# EAGLE design sra_board_2020 (EAGLE 9.6.2)
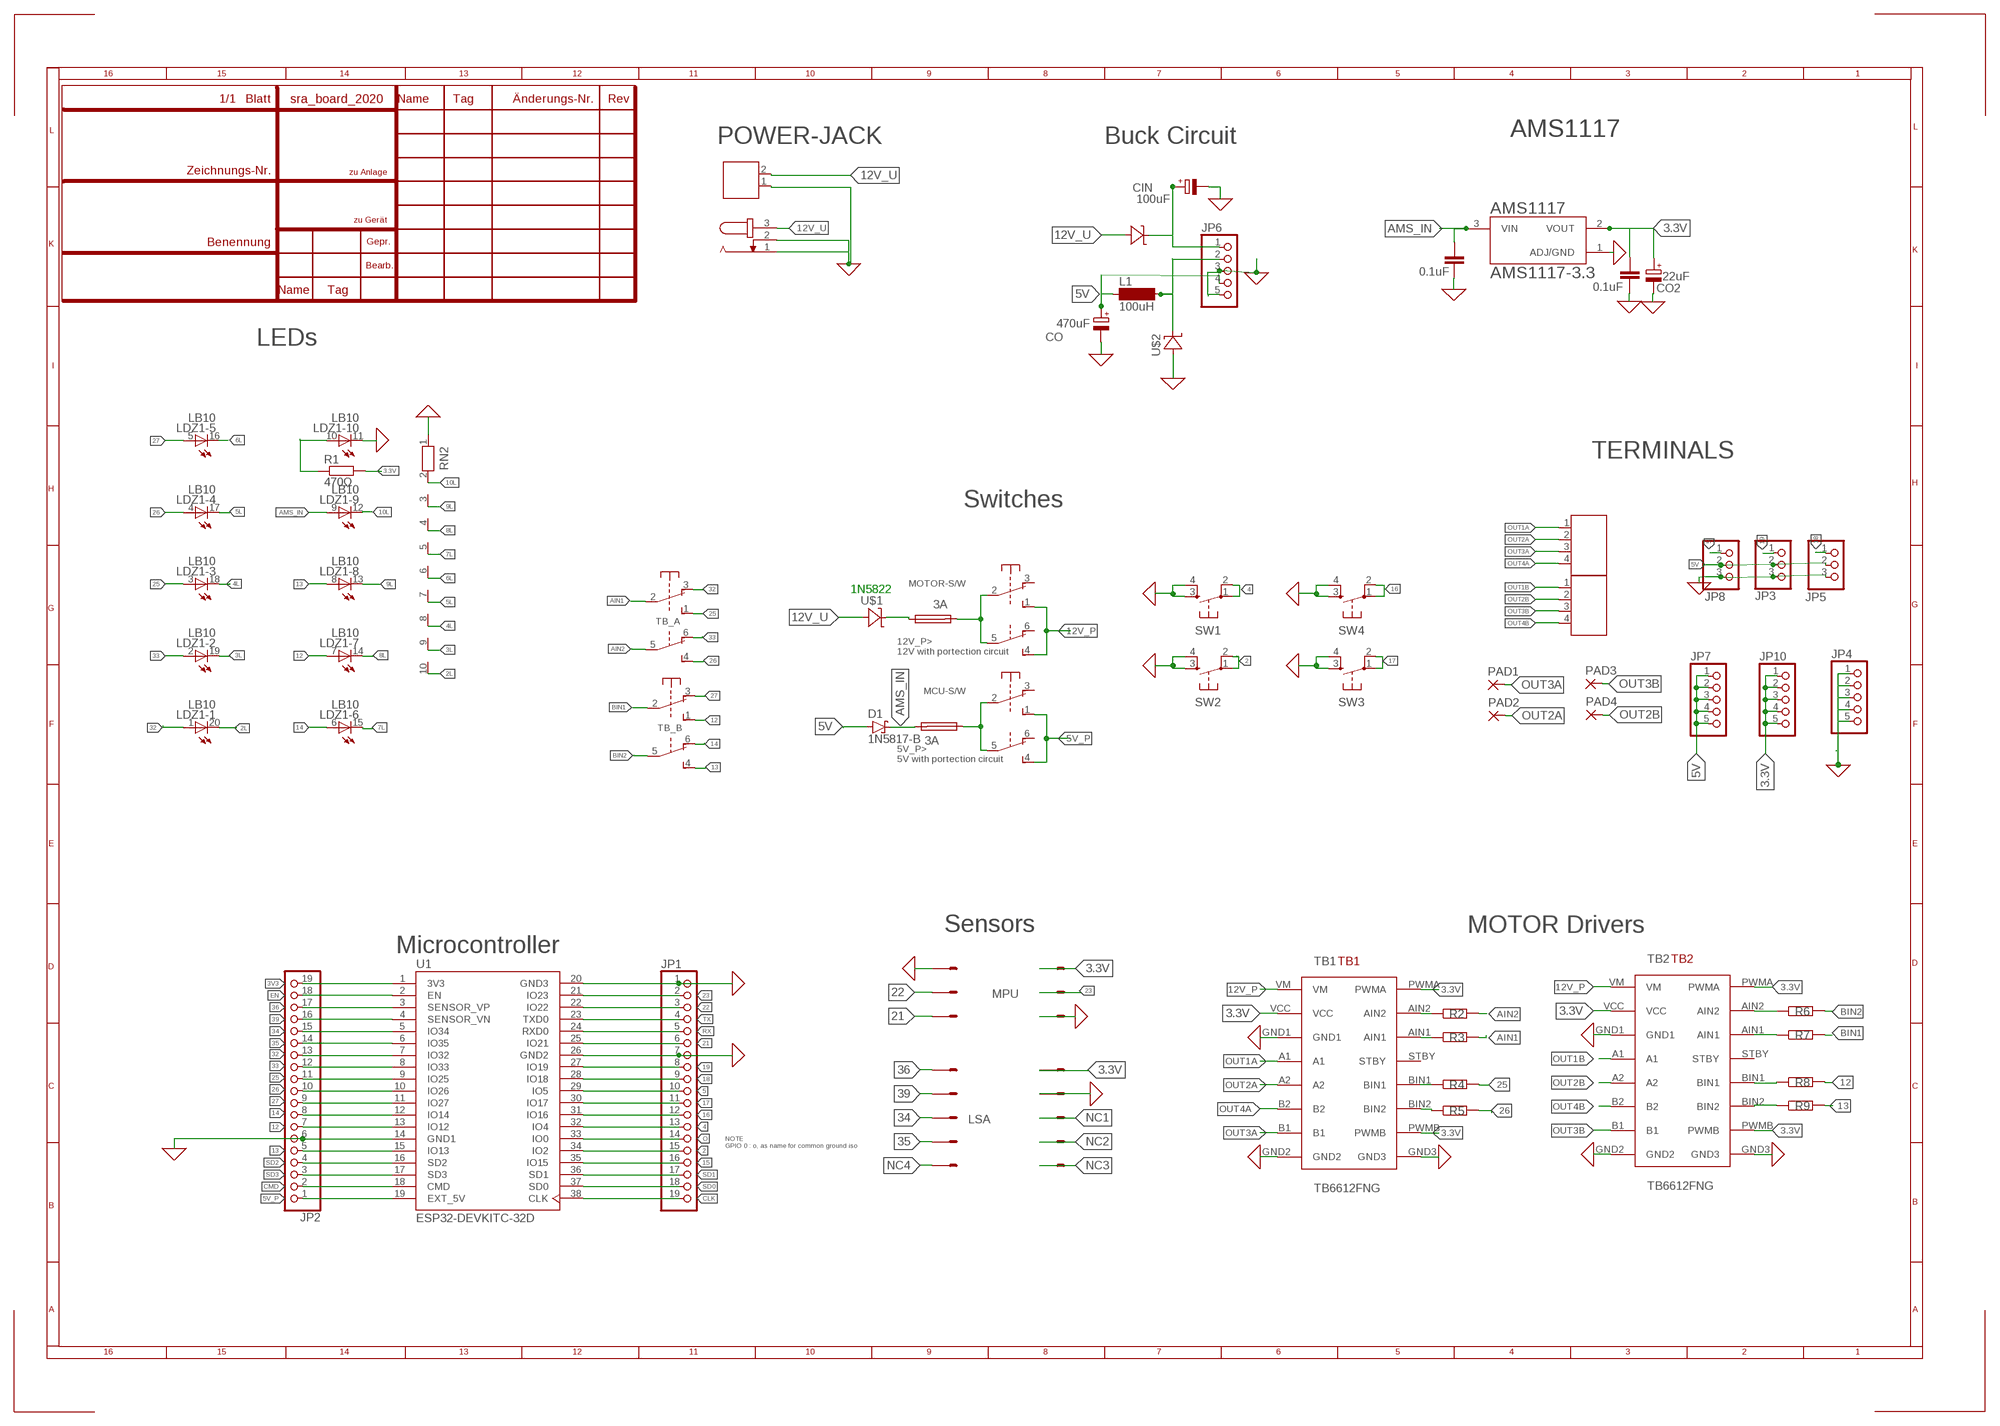
[diagram p0: schematic, sheet 1]

## Parts
12V  691131710002  [691131710002]
AMS1117  AMS1117-3.3  [SOT229P700X180-4N]
CIN  100uF  CPOL-EUE2.5-6  [E2,5-6]
CIN1  0.1uF  C5/2.5  [C5B2.5]
CO  470uF  CPOL-EUE3.5-10  [E3,5-10]
CO1  0.1uF  C5/2.5  [C5B2.5]
CO2  22uF  CPOL-EUE2.5-6  [E2,5-6]
D1  1N5817-B  [DO41-7.6]
F2  3A  SH25  [SH25]
F3  3A  SH25  [SH25]
J1  691131710004  [691131710004]
J2  691131710004  [691131710004]
JP1  PINHD-1X19  [1X19]
JP2  PINHD-1X19  [1X19]
JP3  PINHD-1X3  [1X03]
JP4  PINHD-1X5  [1X05]
JP5  PINHD-1X3  [1X03]
JP6  PINHD-1X5  [1X05]
JP7  PINHD-1X5  [1X05]
JP8  PINHD-1X3  [1X03]
JP10  PINHD-1X5  [1X05]
L1  100uH  SD12K100  [SD12K100]
LDZ1  LB10  [LB10]
LINE-SENSOR  057-010-1  [057-010-1]
MCU-S/W  9077-2  [9077-2]
MOTOR-S/W  9077-2  [9077-2]
PAD1  SMD2  [SMD1,27-2,54]
PAD2  SMD2  [SMD1,27-2,54]
PAD3  SMD2  [SMD1,27-2,54]
PAD4  SMD2  [SMD1,27-2,54]
POWER-JACK  JACK-PLUG1  [SPC4078]
R1  470Ω  R-EU_0204/7  [0204/7]
R2  1KΩ  R-EU_0204/7  [0204/7]
R3  1KΩ  R-EU_0204/7  [0204/7]
R4  1KΩ  R-EU_0204/7  [0204/7]
R5  1KΩ  R-EU_0204/7  [0204/7]
R6  1KΩ  R-EU_0204/7  [0204/7]
R7  1KΩ  R-EU_0204/7  [0204/7]
R8  1KΩ  R-EU_0204/7  [0204/7]
R9  1KΩ  R-EU_0204/7  [0204/7]
RN2  RN09  [RN-10]
SW1  DTS-6  [DTS-6]
SW2  DTS-6  [DTS-6]
SW3  DTS-6  [DTS-6]
SW4  DTS-6  [DTS-6]
TB1  TB6612FNG  [TB6612FNG]
TB2  TB6612FNG  [TB6612FNG]
TB_A  9077-2  [9077-2]
TB_B  9077-2  [9077-2]
U1  ESP32-DEVKITC-32D  [MODULE_ESP32-DEVKITC-32D]
U$1  1N5399_SQUARE  [C2673]
U$2  1N5399_SQUARE  [C2673]
U$3  1N5399_ROUND  [D-10]
X1  057-006-1  [057-006-1]

## Nets
0: 12V.1 AMS1117.1(ADJ/GND) CIN1.1 CIN.- CO1.1 CO2.- CO.- JP1.1 JP1.7 JP2.6 JP3.3 JP4.1 JP4.2 JP4.3 JP4.4 JP4.5 JP5.3 JP6.3 JP6.5 JP8.3 LDZ1.11(-10:C) LINE-SENSOR.4 POWER-JACK.1 POWER-JACK.2 RN2.1 SW1.3 SW1.4 SW2.3 SW2.4 SW3.3 SW3.4 SW4.3 SW4.4 TB1.GND1 TB1.GND2 TB1.GND3 TB2.GND1 TB2.GND2 TB2.GND3 U1.14(GND1) U1.20(GND3) U1.26(GND2) U$2.A X1.1 X1.6 ; supply symbol labelled GND
2: JP1.15 SW2.1 SW2.2 U1.34(IO2)
2L: LDZ1.20(-1:C) RN2.10
3.3V: AMS1117.2(VOUT) CO1.2 CO2.+ JP10.1 JP10.2 JP10.3 JP10.4 JP10.5 LINE-SENSOR.2 R1.2 TB1.PWMA TB1.PWMB TB1.VCC TB2.PWMA TB2.PWMB TB2.VCC X1.2
3L: LDZ1.19(-2:C) RN2.9
3V3: JP2.19 U1.1(3V3)
4: JP1.13 SW1.1 SW1.2 U1.32(IO4)
4L: LDZ1.18(-3:C) RN2.8
5: JP1.10 JP8.1 U1.29(IO5)
5_AF: F2.1 MCU-S/W.2(1:P) MCU-S/W.5(2:P)
5L: LDZ1.17(-4:C) RN2.7
5V: CO.+ D1.A JP3.2 JP5.2 JP6.4 JP7.1 JP7.2 JP7.3 JP7.4 JP7.5 JP8.2 L1.1
5V_P: JP2.1 MCU-S/W.1(1:S) MCU-S/W.4(2:S) U1.19(EXT_5V)
6L: LDZ1.16(-5:C) RN2.6
7L: LDZ1.15(-6:C) RN2.5
8L: LDZ1.14(-7:C) RN2.4
9L: LDZ1.13(-8:C) RN2.3
10L: LDZ1.12(-9:C) RN2.2
12: JP2.7 LDZ1.7(-7:A) R8.2 TB_B.1(1:S) U1.13(IO12)
12V_AF: F3.2 MOTOR-S/W.2(1:P) MOTOR-S/W.5(2:P)
12V_P: MOTOR-S/W.1(1:S) MOTOR-S/W.4(2:S) TB1.VM TB2.VM
12V_U: 12V.2 POWER-JACK.3 U$1.A U$3.A
13: JP2.5 LDZ1.8(-8:A) R9.2 TB_B.4(2:S) U1.15(IO13)
14: JP2.8 LDZ1.6(-6:A) TB_B.6(2:O) U1.12(IO14)
15: JP1.16 U1.35(IO15)
16: JP1.12 SW4.1 SW4.2 U1.31(IO16)
17: JP1.11 SW3.1 SW3.2 U1.30(IO17)
18: JP1.9 JP5.1 U1.28(IO18)
19: JP1.8 JP3.1 U1.27(IO19)
21: JP1.6 U1.25(IO21) X1.5
22: JP1.3 U1.22(IO22) X1.3
23: JP1.2 U1.21(IO23) X1.4
25: JP2.11 LDZ1.3(-3:A) R4.2 TB_A.1(1:S) U1.9(IO25)
26: JP2.10 LDZ1.4(-4:A) R5.2 TB_A.4(2:S) U1.10(IO26)
27: JP2.9 LDZ1.5(-5:A) TB_B.3(1:O) U1.11(IO27)
32: JP2.13 LDZ1.1(-1:A) TB_A.3(1:O) U1.7(IO32)
33: JP2.12 LDZ1.2(-2:A) TB_A.6(2:O) U1.8(IO33)
34: JP2.15 LINE-SENSOR.5 U1.5(IO34)
35: JP2.14 LINE-SENSOR.7 U1.6(IO35)
36: JP2.17 LINE-SENSOR.1 U1.3(SENSOR_VP)
39: JP2.16 LINE-SENSOR.3 U1.4(SENSOR_VN)
AIN1: R3.2 TB_A.2(1:P)
AIN2: R2.2 TB_A.5(2:P)
AMS_IN: AMS1117.3(VIN) CIN1.2 D1.C F2.2 LDZ1.9(-9:A)
BIN1: R7.2 TB_B.2(1:P)
BIN2: R6.2 TB_B.5(2:P)
CLK: JP1.19 U1.38(CLK)
CMD: JP2.2 U1.18(CMD)
EN: JP2.18 U1.2(EN)
N$1: LDZ1.10(-10:A) R1.1
N$3: R2.1 TB1.AIN2
N$4: R3.1 TB1.AIN1
N$5: R4.1 TB1.BIN1
N$6: R5.1 TB1.BIN2
N$7: R6.1 TB2.AIN2
N$8: R7.1 TB2.AIN1
N$9: R8.1 TB2.BIN1
N$10: R9.1 TB2.BIN2
N$11: JP6.2 L1.2 U$2.C
N$12: F3.1 U$1.C
N$13: CIN.+ JP6.1 U$3.C
NC1: LINE-SENSOR.6
NC2: LINE-SENSOR.8
NC3: LINE-SENSOR.10
NC4: LINE-SENSOR.9
O: JP1.14 U1.33(IO0)
OUT1A: J1.1 TB1.A1
OUT1B: J2.1 TB2.A1
OUT2A: J1.2 PAD2.1(P) TB1.A2
OUT2B: J2.2 PAD4.1(P) TB2.A2
OUT3A: J1.3 PAD1.1(P) TB1.B1
OUT3B: J2.3 PAD3.1(P) TB2.B1
OUT4A: J1.4 TB1.B2
OUT4B: J2.4 TB2.B2
RX: JP1.5 U1.24(RXD0)
SD0: JP1.18 U1.37(SD0)
SD1: JP1.17 U1.36(SD1)
SD2: JP2.4 U1.16(SD2)
SD3: JP2.3 U1.17(SD3)
TX: JP1.4 U1.23(TXD0)
Unconnected: MCU-S/W.3(1:O) MCU-S/W.6(2:O) MOTOR-S/W.3(1:O) MOTOR-S/W.6(2:O) TB1.STBY TB2.STBY

## Notes on the sheet
- Buck Circuit | AMS1117
- LEDs
- TERMINALS
- Switches
- 1N5822
- 12V_P>
  12V with portection circuit
- 5V_P> 
  5V with portection circuit
- MOTOR Drivers
- Microcontroller | Sensors
- MPU
- LSA
- NOTE
  GPIO 0 : o, as name for common ground iso

## Library data of the parts
12V = Wurth_Elektronik_Electromechanic_Terminal_Blocks_Connectors_rev16b:691131710002: WR-TBL Terminal block - CUU5/2 CUU5/2GR - 2 Pins;=>Code : Con_TBL_Screw_PClamp_5.00_6911317100xx_691131710002 <http://katalog.we-online.de/media/images/eican/Con_TBL_Screw_PClamp_5.00_6911317100xx_pf2.jpg> Details see: http://katalog.we-online.de/em/datasheet/6911317100xx.pdf Created 11/23/2014, Karrer Zheng 2014 (C) Wurth Elektronik
AMS1117 = AMS1117-3.3:AMS1117-3.3: Sot223/Pkg 1-Amp 3.3-Volt Low Drop Out Voltage Regulatator; AVAILABILITY: Unavailable; DESCRIPTION: Sot223/Pkg 1-Amp 3.3-Volt Low Drop Out Voltage Regulatator; MF: Advanced Monolithic Systems; MP: AMS1117-3.3; PACKAGE: None; PRICE: None
CIN CO CO2 = rcl:CPOL-EU: POLARIZED CAPACITOR, European symbol; SPICEPREFIX: C
CIN1 CO1 = capacitor-wima:C: CAPACITOR naming: grid - package width
D1 = diode:1N581*: 1.0A SCHOTTKY BARRIER RECTIFIER Source: http://www.diodes.com/datasheets/ds23001.pdf
F2 F3 = fuse:SH25: FUSE HOLDER grid 25 mm, OGN0031 8211, Schurter (Buerklin); MF: SCHURTER; MPN: 0031.8211; OC_FARNELL: 1162741; OC_NEWARK: 96B9380
J1 J2 = Wurth_Elektronik_Electromechanic_Terminal_Blocks_Connectors_rev16b:691131710004: WR-TBL Terminal block - CUU5/4 - 4 Pins;=>Code : Con_TBL_Screw_PClamp_5.00_6911317100xx_691131710004 <http://katalog.we-online.de/media/images/eican/Con_TBL_Screw_PClamp_5.00_6911317100xx_pf2.jpg> Details see: http://katalog.we-online.de/em/datasheet/6911317100xx.pdf Created 11/3/2014, Karrer Zheng 2014 (C) Wurth Elektronik
JP1 JP2 = pinhead:PINHD-1X19: PIN HEADER
JP3 JP5 JP8 = pinhead_2:PINHD-1X3: PIN HEADER
JP4 JP7 JP10 = pinhead_2:PINHD-1X5: PIN HEADER
JP6 = pinhead:PINHD-1X5: PIN HEADER
L1 = inductor-neosid:SD12: INDUCTOR nominal inductance; OC_FARNELL: unknown; OC_NEWARK: unknown
LDZ1 = led:LB10: LED BLOCK 10-LED bar graph, DIL, Siemens
LINE-SENSOR = con-panduit:057-010-: CONNECTOR 10-pin series 057 contact pc board low profile headers; OC_FARNELL: unknown; OC_NEWARK: unknown
MCU-S/W MOTOR-S/W TB_A TB_B = switch-misc:9077-2: MARQUARDT SWITCH 9077.0200 Distributor: Buerklin <https://www.buerklin.com/default.asp?event=ShowArtikel%2812G2822%29&l=d&jump=ArtNr_12G2822>
PAD1-PAD4 = wirepad_2:SMD2: SMD PAD
POWER-JACK = con-jack:JACK-PLUG: DC POWER JACK Power Jack, DC, Right Angle, Through Hole, Rated 5A at 16VDC, PC Terminals Distributor: Farnell (www.Farnell.de) Drawing: 84N1161.pdf / 84N1162.pdf Manufacturer: SPC Technology (www.spctechnology.com) Type: SPC4077 / SPC 4078; OC_FARNELL: unknown; OC_NEWARK: unknown
R1-R9 = rcl:R-EU_: RESISTOR, European symbol; SPICEPREFIX: R
RN2 = resistor-net:RN09: RESISTOR NETWORK; OC_FARNELL: unknown; OC_NEWARK: unknown
SW1-SW4 = switch-tact:DTS-6
TB1 TB2 = TB6612FNG:TB6612FNG
U1 = ESP32-DEVKITC-32D:ESP32-DEVKITC-32D: Eval Board For Esp-Wroom-32; AVAILABILITY: Unavailable; DESCRIPTION: - Transceiver; 802.11 b/g/n _Wi-Fi, WiFi, WLAN_, Bluetooth® Smart Ready 4.x Dual Mode For Use With ESP-WROOM-32; MF: Espressif Systems; MP: ESP32-DEVKITC-32D; PACKAGE: None; PRICE: None
U$1 U$2 = diode_updated:1N5399_SQUARE
U$3 = diode_updated:1N5399_ROUND
X1 = con-panduit:057-006-: CONNECTOR 6-pin series 057 contact pc board low profile headers; OC_FARNELL: unknown; OC_NEWARK: unknown

## Board
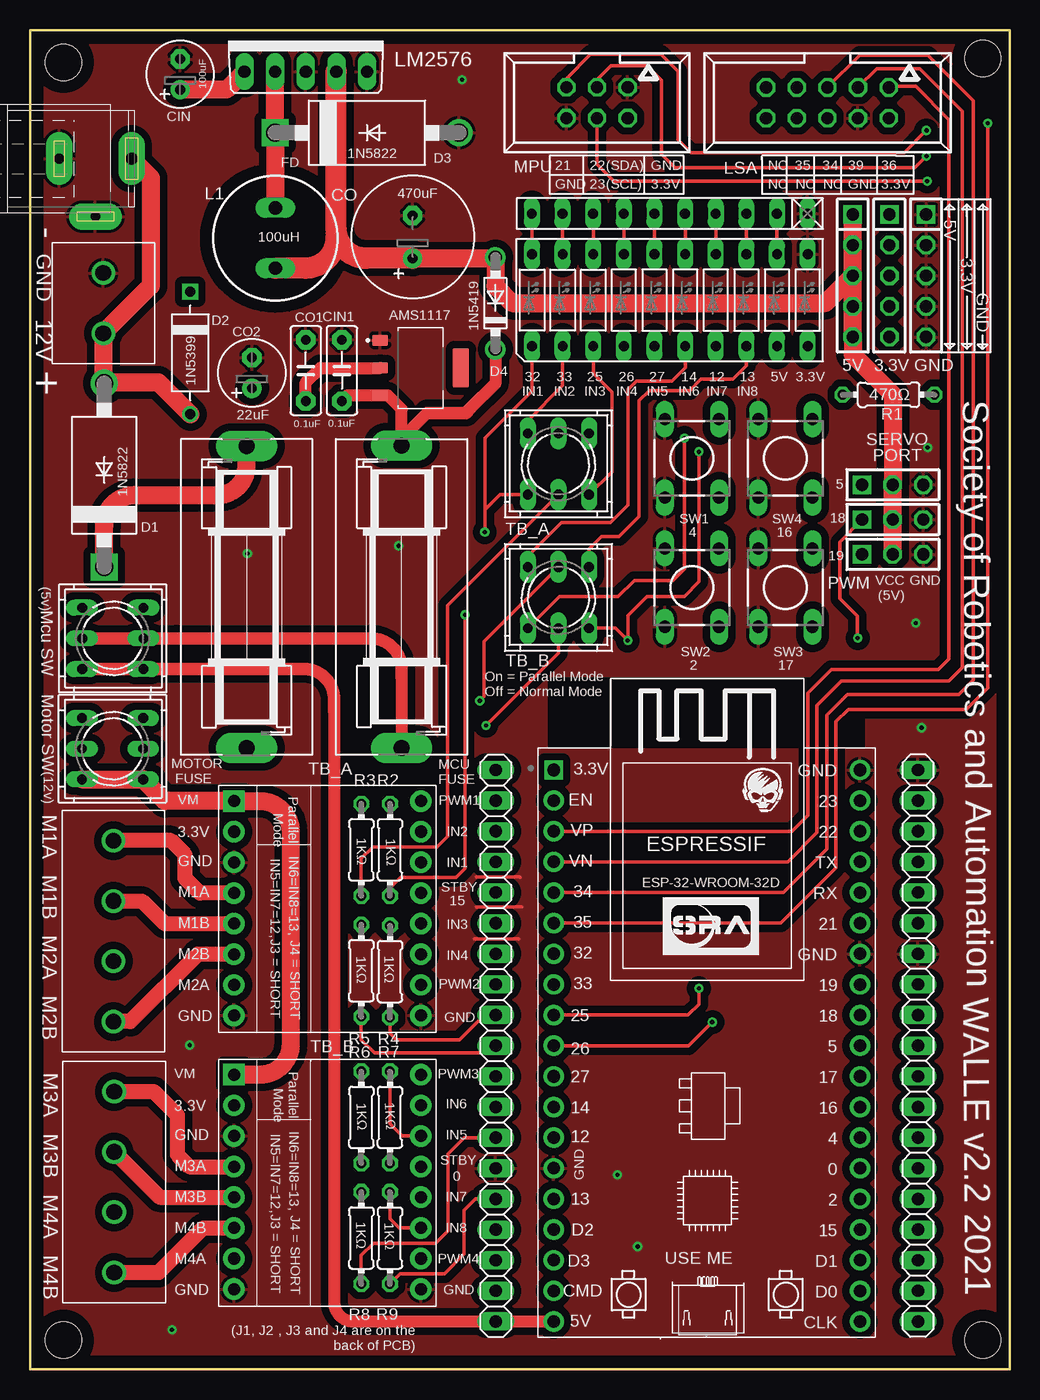
[diagram p1: board, top side]
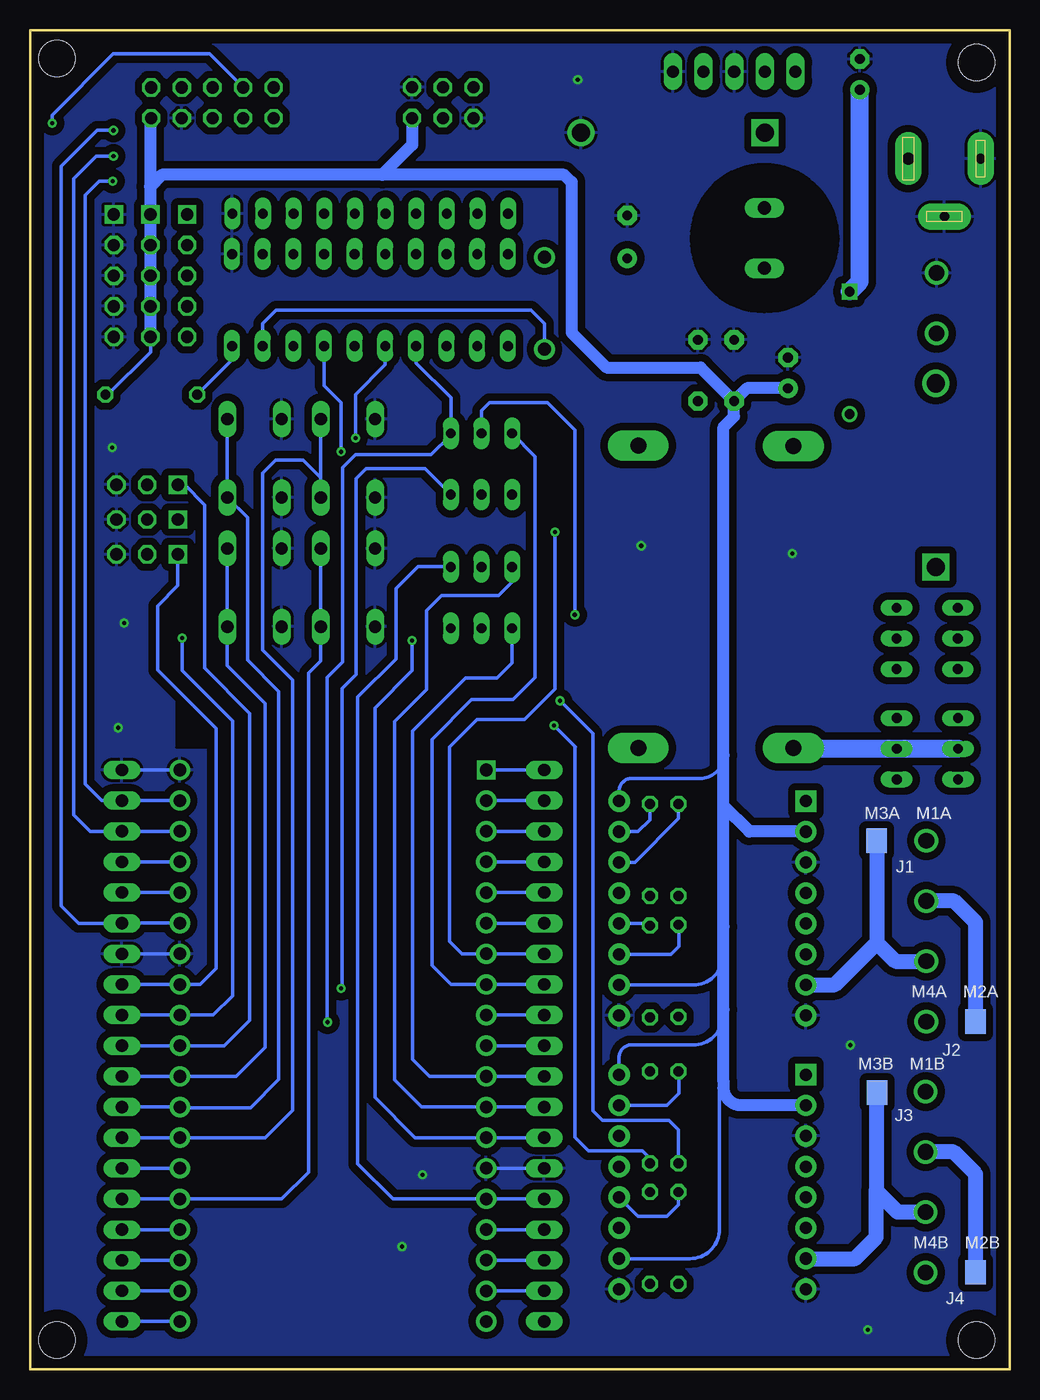
[diagram p2: board, bottom side, seen from below]

Size 81.21 x 111.01 mm. Coordinates in mm from the lower left corner, seen from the top.
Outline: 0,111.01 81.21,111.01 81.21,0 0,0.02 0,111.01
Copper layers (1*16): Top 0.035mm / dielectric 1.5mm / Bottom 0.035mm
Design rules "default": minimum track width 6mil, minimum drill 0.35mm, track to track 6mil, track to pad 6mil, pad to pad 6mil, via to via 6mil, smd to smd 6mil, copper to edge 40mil, drill to drill 6mil, minimum pad ring 10mil, minimum via ring 8mil, stop-mask expansion 4mil, vias tented up to drill 0mil, thermal gap 10mil
Holes 3 mm at 2.75,2.42 78.98,2.42 2.75,108.34 78.98,108.67

### Footprints (pad centres in the part's own frame; a part is rotated, then mirrored left to right if it is on the bottom)
691131710002 = drill 1.3: 1 -2.5,0; 2 2.5,0
SOT229P700X180-4N = smd 0.93 x 1.31: 1 -2.29,-3.345; 2 0,-3.345; 3 2.29,-3.345 | smd 3.24 x 1.31: 4 0,3.345
E2,5-6 = drill 0.813 pad 1.6: + -1.27,0 | drill 0.813 pad 1.6 octagon: - 1.27,0
C5B2.5 = drill 0.813 pad 1.6 octagon: 1 -2.54,0; 2 2.54,0
E3,5-10 = drill 0.813 pad 1.6: + -1.778,0 | drill 0.813 pad 1.6 octagon: - 1.778,0
DO41-7.6 = drill 1.1 pad 1.7: A 3.81,0; C -3.81,0
SH25 = drill 1.321 pad 2.54 long: 1 -12.522,0; 2 12.522,0
691131710004 = drill 1.3: 1 -7.5,0; 2 -2.5,0; 3 2.5,0; 4 7.5,0
1X19 = drill 1.016 long: 1 -22.86,0; 2 -20.32,0; 3 -17.78,0; 4 -15.24,0; 5 -12.7,0; 6 -10.16,0; 7 -7.62,0; 8 -5.08,0; 9 -2.54,0; 10 0,0; 11 2.54,0; 12 5.08,0; 13 7.62,0; 14 10.16,0; 15 12.7,0; 16 15.24,0; 17 17.78,0; 18 20.32,0; 19 22.86,0
1X03 = drill 1.016 square: 1 -2.54,0 | drill 1.016 octagon: 2 0,0; 3 2.54,0
1X05 = drill 1.016 square: 1 -5.08,0 | drill 1.016 octagon: 2 -2.54,0; 3 0,0; 4 2.54,0; 5 5.08,0
1X05' = drill 1.016 long: 1 -5.08,0; 2 -2.54,0; 3 0,0; 4 2.54,0; 5 5.08,0
SD12K100 = drill 1.1 long: 1 -2.5,0; 2 2.5,0
LB10 = drill 0.813 long: 1 -11.43,-3.81; 2 -8.89,-3.81; 3 -6.35,-3.81; 4 -3.81,-3.81; 5 -1.27,-3.81; 6 1.27,-3.81; 7 3.81,-3.81; 8 6.35,-3.81; 9 8.89,-3.81; 10 11.43,-3.81; 11 11.43,3.81; 12 8.89,3.81; 13 6.35,3.81; 14 3.81,3.81; 15 1.27,3.81; 16 -1.27,3.81; 17 -3.81,3.81; 18 -6.35,3.81; 19 -8.89,3.81; 20 -11.43,3.81
057-010-1 = drill 1 octagon: 1 -5.08,-1.27; 2 -5.08,1.27; 3 -2.54,-1.27; 4 -2.54,1.27; 5 0,-1.27; 6 0,1.27; 7 2.54,-1.27; 8 2.54,1.27; 9 5.08,-1.27; 10 5.08,1.27
9077-2 = drill 0.813 long: 1 -2.54,2.54; 2 0,2.54; 3 2.54,2.54; 4 -2.54,-2.54; 5 0,-2.54; 6 2.54,-2.54
SMD1,27-2,54 = smd 1.7 x 2 bottom: 1 0,0
SPC4078 = drill 0.8 pad 2.184 long: 1 -3,0; 2 0,-4.8 | drill 1 pad 2.184 long: 3 3,0
0204/7 = drill 0.813 octagon: 1 -3.81,0; 2 3.81,0
RN-10 = drill 0.813 long: 1 -11.43,0; 2 -8.89,0; 3 -6.35,0; 4 -3.81,0; 5 -1.27,0; 6 1.27,0; 7 3.81,0; 8 6.35,0; 9 8.89,0; 10 11.43,0
DTS-6 = drill 1 long: 1 -3.25,2.25; 2 3.25,2.25; 3 -3.25,-2.25; 4 3.25,-2.25
TB6612FNG = drill 1 pad 1.778: A1 -7.62,-1.27; A2 -7.62,-3.81; AIN1 7.874,1.27; AIN2 7.874,3.81; B1 -7.62,-8.89; B2 -7.62,-6.35; BIN1 7.874,-3.81; BIN2 7.874,-6.35; GND1 -7.62,1.27; GND2 -7.62,-11.43; GND3 7.874,-11.43; PWMA 7.874,6.35; PWMB 7.874,-8.89; STBY 7.874,-1.27; VCC -7.62,3.81 | drill 1 pad 1.778 square: VM -7.62,6.35
MODULE_ESP32-DEVKITC-32D = drill 1.04 square: 1 -12.7,19.76 | drill 1.04 pad 1.676: 2 -12.7,17.22; 3 -12.7,14.68; 4 -12.7,12.14; 5 -12.7,9.6; 6 -12.7,7.06; 7 -12.7,4.52; 8 -12.7,1.98; 9 -12.7,-0.56; 10 -12.7,-3.1; 11 -12.7,-5.64; 12 -12.7,-8.18; 13 -12.7,-10.72; 14 -12.7,-13.26; 15 -12.7,-15.8; 16 -12.7,-18.34; 17 -12.7,-20.88; 18 -12.7,-23.42; 19 -12.7,-25.96; 20 12.7,19.76; 21 12.7,17.22; 22 12.7,14.68; 23 12.7,12.14; 24 12.7,9.6; 25 12.7,7.06; 26 12.7,4.52; 27 12.7,1.98; 28 12.7,-0.56; 29 12.7,-3.1; 30 12.7,-5.64; 31 12.7,-8.18; 32 12.7,-10.72; 33 12.7,-13.26; 34 12.7,-15.8; 35 12.7,-18.34; 36 12.7,-20.88; 37 12.7,-23.42; 38 12.7,-25.96
C2673 = drill 1.499: A 7.62,0 | drill 1.499 square: C -7.62,0
D-10 = drill 0.813: A 5.08,0 | drill 0.813 square: C -5.08,0
057-006-1 = drill 1 octagon: 1 -2.54,-1.27; 2 -2.54,1.27; 3 0,-1.27; 4 0,1.27; 5 2.54,-1.27; 6 2.54,1.27

### Placement (x,y rotation side)
12V  6.06,88.38 270 top
AMS1117  32.37,83.01 270 top
CIN  12.43,107.35 90 top
CIN1  25.85,82.8 270 top
CO  31.71,93.87 90 top
CO1  22.85,82.8 270 top
CO2  18.38,82.59 90 top
D1  38.57,88.38 90 top
F2  30.8,64.03 90 top
F3  17.94,64.02 270 top
J1  6.92,36.33 270 top
J2  6.97,15.53 270 top
JP1  73.6,26.82 270 top
JP2  38.6,26.82 90 top
JP3  71.51,67.56 0 top
JP4  74.27,90.66 270 top
JP5  71.51,70.44 0 top
JP6  [1X05']  22.85,107.57 0 top
JP7  68.19,90.66 270 top
JP8  71.51,73.33 0 top
JP10  71.23,90.66 270 top
L1  20.34,93.78 90 top
LDZ1  53.04,88.64 0 top
LINE-SENSOR  66.1,104.99 180 top
MCU-S/W  6.84,60.59 90 top
MOTOR-S/W  6.83,51.44 90 top
PAD1  11.02,43.83 0 top
PAD2  2.82,28.82 0 top
PAD3  11.01,22.93 0 top
PAD4  2.82,8.04 0 top
POWER-JACK  5.41,100.36 0 top
R1  71.16,80.79 0 top
R2  29.82,43.07 270 top
R3  27.45,43.07 270 top
R4  29.82,32.97 270 top
R5  27.45,33.04 270 top
R6  27.45,20.89 270 top
R7  29.82,20.89 270 top
R8  27.45,10.89 270 top
R9  29.82,10.89 270 top
RN2  53.02,95.81 180 top
SW1  54.86,75.52 270 top
SW2  54.86,64.81 270 top
SW3  62.61,64.81 270 top
SW4  62.61,75.52 270 top
TB1  24.52,40.76 0 top
TB2  24.52,18.07 0 top
TB_A  43.8,75.05 180 top
TB_B  43.8,63.97 180 top
U1  56.1,29.93 0 top
U$1  6.14,74.11 90 top
U$2  27.93,102.5 0 top
U$3  13.27,84.26 270 top
X1  47,105 180 top

### Tracks (layer width: path | path; a pad name or v marks a point on that pad's centre or on a via)
0  (via drill 0.35)
  Top 0.305: 37.03,40.81 40.6,40.81 40.62,40.79 | 36.98,38.32 40.73,38.32 40.76,38.35 | 36.84,35.7 40.47,35.7
  Bottom 0.305: U1.26 JP1.7 | U1.20 JP1.1 | JP2.6 U1.14
  other vias: 13.22,26.88 73.9,53.18 30.55,68.26 18.01,67.63 11.76,3.27 35.82,106.91 74.41,76.41 73.42,61.87 50.37,10.18 48.68,16.12
  pour Bottom (isolate 0.61, rank 2): -2.32,112.05 -2.32,-0.63 4.51,-0.63 83.25,-0.63 83.25,6.15 83.25,112.07 -2.32,112.07
  pour Top (isolate 0.61, rank 2): -2.31,112.04 -2.31,-0.65 0.43,-0.65 83.26,-0.65 83.26,4.25 83.26,112.06 -2.31,112.06
  cutout Top: 43.03,51.52 43.03,57.27 43.08,57.32 69.12,57.32 69.12,51.57 43.03,51.57
  cutout Bottom: 43.03,51.52 43.03,57.32 48.98,57.32 69.12,57.32 69.12,51.57 43.03,51.57
2
  Bottom 0.305: SW2.1 SW2.2 57.11,58.71 58.12,57.7 58.12,16.35 60.34,14.13 U1.34 JP1.15
2L
  Top 0.305: LDZ1.20 41.61,95.8 RN2.10
3.3V
  Top 1: CO1.2 22.85,81.82 24.04,83.01 AMS1117.2
  Bottom 0.305: 23.73,23.85 24.06,23.52 24.06,11.62 arc90 26.5,9.18 TB2.PWMB | JP10.5 71.23,84.34 74.78,80.79 R1.2 | TB1.PWMA 32.39,47.92 arc90 31.32,48.99 25.66,48.99 arc-90 23.73,50.93 | TB1.PWMB 26.27,31.87 arc-90 23.73,34.41 23.73,36.68 | TB2.PWMA 32.39,25.86 arc90 31.36,26.89 26.27,26.89 arc-90 23.73,29.43 23.73,29.82
  Bottom 1: TB2.VCC 22.23,21.88 arc90 23.73,23.39 23.73,23.85 23.73,29.82 23.73,36.68 23.73,46.71 | CO2.+ 21.78,81.32 CO1.2 | CO1.2 25.64,83.05 33.42,83.05 36.32,85.95 36.32,98.41 36.94,99.02 52.02,99.02 | 71.27,98.05 70.29,99.02 52.02,99.02 | 71.27,98.05 71.28,98.04 71.28,103.62 LINE-SENSOR.2 | 71.27,98.05 71.27,95.77 JP10.1 JP10.2 JP10.3 JP10.4 JP10.5 | X1.2 49.54,101.51 52.02,99.02 | 23.73,46.71 23.73,50.93 23.73,78.11 22.85,78.99 CO1.2 | TB1.VCC 21.59,44.57 23.73,46.71
3L
  Top 0.305: LDZ1.19 44.15,95.8 RN2.9
3V3
  Bottom 0.305: JP2.19 U1.1
4
  Bottom 0.305: SW1.1 SW1.2 57.11,73.92 58.56,75.37 60.85,75.37 61.92,74.3 61.92,59.63 59.45,57.15 59.45,21.49 61.73,19.21 U1.32 JP1.13
4L
  Top 0.305: LDZ1.18 46.69,95.8 RN2.8
5
  Bottom 0.305: JP1.10 U1.29 65.12,26.83 63.01,28.94 63.01,54.38 66.75,58.12 66.75,71.66 68.42,73.33 JP8.1
5_AF
  Top 1: 30.79,57.4 F2.1
  Top 1.016: MCU-S/W.2 MCU-S/W.5 12.12,60.59 28.25,60.59 arc-90 30.79,58.05 30.79,57.4
5L
  Top 0.305: LDZ1.17 49.23,95.8 RN2.7
5V
  Top 1.5: JP7.3 JP7.4 JP7.5 68.2,84.12 71.51,80.8 JP8.2 JP5.2 JP3.2 | JP7.3 JP7.2 JP7.1 | JP7.3 65.94,88.4 39.96,88.4 38.57,89.79 D1.A 38.48,92.09 CO.+
  Top 1.75: 25.36,94.63 25.36,93.82 arc-90 22.82,91.28 L1.1 | CO.+ 27.9,92.09 arc-90 25.36,94.63 | 25.36,94.63 25.36,107.54 arc-90 JP6.4
5V_P
  Top 1: U1.19 arc90 U1.19 arc-90 U1.19 | 25.21,54.56 25.21,5.55 arc90 26.8,3.96 JP2.1 U1.19
  Top 1.016: MCU-S/W.1 MCU-S/W.4 22.67,58.05 arc-90 25.21,55.51 25.21,54.56
6L
  Top 0.305: LDZ1.16 51.77,95.8 RN2.6
7L
  Top 0.305: LDZ1.15 54.31,95.8 RN2.5
8L
  Top 0.305: LDZ1.14 56.85,95.8 RN2.4
9L
  Top 0.305: LDZ1.13 59.39,95.8 RN2.3
10L
  Top 0.305: LDZ1.12 61.93,95.8 RN2.2
12  (via drill 0.35)
  Top 0.305: TB_B.1 48.54,61.43 v49.54,60.42 49.54,62.48 51.14,64.07 54.22,64.07 55.44,65.3 v55.44,76.06 | R8.2 27.45,9.46 28.46,10.46 33.62,10.46 34.63,11.47 34.63,17.84 35.99,19.2 JP2.7
  Bottom 0.305: v49.54,60.42 49.54,57.91 52.62,54.84 52.62,22.54 49.29,19.21 U1.13 JP2.7 | LDZ1.7 56.85,81.56 55.44,80.16 v55.44,76.06
12V_AF
  Bottom 1.5: MOTOR-S/W.2 MOTOR-S/W.5 17.89,51.44 arc90 F3.2
12V_P
  Top 1.5: MOTOR-S/W.1 MOTOR-S/W.4 11.16,47.11 TB1.VM 19.06,47.11 arc-90 21.6,44.57 21.6,26.96 arc-90 19.06,24.42 TB2.VM
12V_U
  Top 1.5: POWER-JACK.3 10,98.77 10,89.82 12V.2 6.06,81.81 | 6.06,81.81 U$1.A | U$3.A 10.64,81.81 6.06,81.81
13
  Top 0.305: TB_B.4 46.34,68.01 47.35,69.03 48.8,69.03 50.48,70.71 50.48,80.29 51.32,81.13 54.69,81.13 55.62,82.06 58.24,82.06 59.39,83.21 LDZ1.8 | R9.2 30.68,7.94 34.34,7.94 35.98,9.58 35.98,13.18 36.92,14.12 JP2.5
  Bottom 0.305: TB_B.4 46.36,66.54 49.06,66.54 50.88,64.72 50.88,58.9 54.05,55.72 54.05,17.04 51.13,14.13 U1.15 JP2.5
14
  Top 0.305: LDZ1.6 54.31,83.04 53.19,81.92 50.25,81.92 49.55,81.22 49.55,71.64 48.1,70.2 44.06,70.2 41.23,67.36 41.23,66.55 TB_B.6
  Bottom 0.305: TB_B.6 41.26,65.26 42.38,64.13 47.11,64.13 48.34,62.89 48.34,56.35 51,53.7 51,23.99 48.75,21.75 U1.12 JP2.8
15
  Bottom 0.305: U1.35 JP1.16
16
  Bottom 0.305: SW4.1 SW4.2 63.19,70.6 63.19,58.79 60.59,56.2 60.59,24.02 62.95,21.67 68.72,21.67 U1.31 JP1.12
17
  Bottom 0.305: JP1.11 U1.30 64.15,24.29 61.73,26.7 61.73,55.2 64.86,58.32 SW3.2 SW3.1
18  (via drill 0.35)
  Top 0.305: JP5.1 67.11,68.58 67.11,63.9 68.57,62.44 68.57,60.62 v68.61,60.62
  Bottom 0.305: v68.61,60.62 68.61,57.91 64.44,53.74 64.44,30.96 66.04,29.37 U1.28 JP1.9
19
  Bottom 0.305: JP3.1 68.97,64.98 70.65,63.29 70.65,57.96 65.8,53.11 65.8,33.22 67.12,31.91 U1.27 JP1.8
21  (via drill 0.35)
  Top 0.305: X1.5 44.46,106.99 46.47,109.01 52.31,109.01 53.71,107.61 53.71,101.92 54.77,100.87 72.48,100.87 v74.31,102.7
  Bottom 0.305: v74.31,102.7 75.67,102.7 78.62,99.74 78.62,38.43 77.18,36.98 JP1.6 U1.25
22  (via drill 0.35)
  Top 0.305: X1.3 47,106.91 48.15,108.06 51.16,108.06 52.36,106.86 52.36,100.71 53.45,99.61 73.36,99.61 v74.31,100.56
  Bottom 0.305: v74.31,100.56 75.73,100.56 77.59,98.69 77.59,45.95 76.25,44.6 JP1.3 U1.22
23  (via drill 0.35)
  Top 0.305: X1.4 47,99.89 48.39,98.5 v74.36,98.5
  Bottom 0.305: v74.36,98.5 75.49,98.5 76.66,97.32 76.66,94.41 76.66,94.4 76.66,48.51 75.29,47.14 JP1.2 U1.21
25  (via drill 0.35)
  Top 0.305: LDZ1.3 46.69,82.52 48.22,80.99 48.22,74.4 TB_A.1 | R4.2 29.82,27.84 30.34,27.32 35.59,27.32 37.7,29.44 38.53,29.44 JP2.11 | v55.44,31.58 55.44,30.25 54.55,29.37 U1.9
  Bottom 0.305: TB_A.1 48.47,74.65 53.38,74.65 54.2,73.82 54.2,57.59 55.37,56.43 55.37,31.65 v55.44,31.58 | JP2.11 U1.9
26  (via drill 0.35)
  Top 0.305: R5.2 27.45,27.32 28.54,26.23 38.01,26.23 JP2.10 | U1.10 54.59,26.83 v56.55,28.79
  Bottom 0.305: LDZ1.4 49.23,83.42 46.34,80.53 TB_A.4 46.34,77.44 47.96,75.83 47.96,75.82 54.23,75.82 55.31,74.74 55.31,58.63 56.59,57.35 56.59,28.82 v56.55,28.79 | U1.10 JP2.10
27  (via drill 0.35)
  Top 0.305: v54.23,77.18 54.23,66.35 53.29,65.41 50.09,65.41 48.73,64.04 43.87,64.04 TB_B.3
  Bottom 0.305: TB_B.3 41.26,58.55 42.49,57.32 45.11,57.32 49.51,52.92 49.51,25.68 48.11,24.28 U1.11 | LDZ1.5 51.77,83.28 54.23,80.81 v54.23,77.18 | JP2.9 U1.11 | U1.11
32  (via drill 0.35)
  Top 0.305: v37.69,69.41 37.69,71.25 | 37.69,71.25 38.95,72.52 TB_A.3 | 37.69,71.25 37.69,77.18 41.61,81.1 LDZ1.1
  Bottom 0.305: v37.69,69.41 37.69,56.41 40.23,53.88 44.16,53.88 46.44,51.59 46.44,35.47 45.42,34.45 U1.7 JP2.13
33
  Top 0.305: TB_A.6 41.26,78.65 44.15,81.54 LDZ1.2
  Bottom 0.305: TB_A.6 39.34,75.68 39.34,57.37 41.18,55.53 44.6,55.53 47.9,52.23 47.9,33.48 46.33,31.91 U1.8 JP2.12
34
  Top 0.305: U1.5 62.43,39.53 66.06,43.15 66.06,54.23 67.76,55.94 76.97,55.94 78.18,57.14 78.18,105.17 74.42,108.93 68.77,108.93 LINE-SENSOR.5
  Bottom 0.305: JP2.15 U1.5
35  (via drill 0.35)
  Top 0.305: U1.6 62.22,36.99 66.81,41.58 66.81,53.69 67.82,54.7 77.6,54.7 79.38,56.49 v79.38,103.3
  Bottom 0.305: v79.38,103.3 79.38,103.97 74.31,109.05 66.34,109.05 LINE-SENSOR.7 | JP2.14 U1.6
36
  Top 0.305: U1.3 63.17,44.61 64.45,45.9 64.45,56.05 66.42,58.01 75.28,58.01 76.17,58.9 76.17,103.59 73.41,106.35 71.27,106.35 LINE-SENSOR.1
  Bottom 0.305: JP2.17 U1.3
39
  Top 0.305: U1.4 62.81,42.07 65.24,44.49 65.24,55.04 67.26,57.06 76.17,57.06 77.28,58.17 77.28,104.28 73.75,107.81 70.19,107.81 LINE-SENSOR.3
  Bottom 0.305: JP2.16 U1.4
AIN1
  Top 0.305: TB_A.2 34.59,63.3 34.59,44.18 33.72,43.3 28.42,43.3 27.45,42.34 R3.2
AIN2  (via drill 0.35)
  Top 0.305: v36.05,62.55 36.05,41.51 35.32,40.77 30.7,40.77 29.82,39.89 R2.2
  Bottom 0.305: v36.05,62.55 36.05,77.87 38.34,80.15 43.13,80.15 43.8,79.48 TB_A.5
AMS_IN
  Top 1: F2.2 30.79,79.58 29.66,80.72 AMS1117.3 26.3,80.72 CIN1.2 | D1.C 38.57,81.71 36.48,79.62
  Top 1.016: 36.48,79.62 36.14,79.28 32.91,79.28 30.79,77.17 F2.2
  Bottom 0.305: D1.C 38.57,86.67 39.71,87.8 60.81,87.8 61.93,86.69 LDZ1.9
BIN1  (via drill 0.35)
  Top 0.305: v37.79,53.37 43.8,59.38 TB_B.2
  Bottom 0.305: v37.79,53.37 36.02,51.59 36.05,51.57 36.05,19.24 34.91,18.1 30.44,18.1 29.82,17.49 R7.2
BIN2  (via drill 0.35)
  Top 0.305: v37.28,55.43 37.61,55.76 37.61,60.33 TB_B.5
  Bottom 0.305: v37.28,55.43 34.57,52.72 34.57,21.43 33.77,20.63 28.24,20.63 27.45,19.85 R6.2
CLK
  Bottom 0.305: U1.38 JP1.19
CMD
  Bottom 0.305: JP2.2 U1.18
COB
  cutout Bottom: 14.18,93.7 14.18,93.75 arc-90 20.34,99.91 arc-90 26.47,93.78 26.47,93.7 arc-90 20.4,87.63 20.29,87.63 20.27,87.63 arc-90 14.18,93.72
COT
  cutout Top: 14.17,93.72 14.17,93.78 arc-90 20.33,99.93 arc-90 26.46,93.8 26.46,93.72 arc-90 20.39,87.65 20.28,87.65 20.26,87.65 arc-90 14.17,93.74
EN
  Bottom 0.305: JP2.18 U1.2
N$1
  Bottom 0.305: R1.1 64.47,83.68 LDZ1.10
N$3
  Bottom 0.305: TB1.AIN2 30.81,44.57 29.82,45.56 R2.1
N$4
  Bottom 0.305: R3.1 27.45,45.67 31.09,42.03 TB1.AIN1
N$5
  Bottom 0.305: R4.1 29.99,36.95 TB1.BIN1
N$6
  Bottom 0.305: TB1.BIN2 28.1,34.41 27.45,35.07 R5.1
N$7
  Bottom 0.305: TB2.AIN2 28.44,21.88 27.43,22.89 27.43,24.68 R6.1
N$8
  Top 0.305: TB2.AIN1 30.84,19.34 29.82,20.36 R7.1
N$9
  Bottom 0.305: TB2.BIN1 30.83,12.7 28.4,12.7 27.45,13.65 R8.1
N$10
  Top 0.305: R9.1 29.82,12.49 30.59,11.72 TB2.BIN2
N$11
  Top 1.5: 20.34,102.47 arc90 U$2.C | U$2.C JP6.2 arc-90 JP6.2 | L1.2 20.34,102.47 | 20.34,102.47 arc90 U$2.C
N$12
  Top 1.5: U$1.C 6.14,69.93 arc-90 8.68,72.47 15.53,72.47 arc90 17.94,74.89 F3.1
N$13
  Top 1.5: JP6.1 16.27,106.08 CIN.+
  Bottom 1.5: U$3.C 12.43,90.18 CIN.+
O
  Bottom 0.305: U1.33 JP1.14
OUT1A
  Top 1.25: TB1.A1 14.06,39.49 12.84,40.71 12.84,42.66 11.68,43.83 J1.1
OUT1B
  Top 1.25: J2.1 10.25,23.03 12.2,21.07 12.2,17.8 13.2,16.8 TB2.A1
OUT2A
  Top 1.25: J1.2 9.28,38.83 11.16,36.95 TB1.A2
  Bottom 1.25: PAD2.1 2.82,37.05 4.6,38.83 J1.2
OUT2B
  Top 1.25: J2.2 10.73,14.26 TB2.A2
  Bottom 1.25: PAD4.1 2.82,16.19 4.65,18.03 J2.2
OUT3A
  Bottom 1.25: PAD1.1 11.02,35.37 | J1.3 9.48,33.83 11.02,35.37 | TB1.B1 14.52,31.87 11.02,35.37
OUT3B
  Bottom 1.25: J2.3 9.29,13.03 11.06,14.8 | PAD3.1 11.06,22.88 11.06,14.8 | TB2.B1 12.84,9.18 11.06,10.96 11.06,14.8
OUT4A
  Top 1.25: TB1.B2 13.88,34.41 8.3,28.83 J1.4
OUT4B
  Top 1.25: J2.4 10.66,8.03 14.35,11.72 TB2.B2
RX
  Bottom 0.305: U1.24 JP1.5
SD0
  Bottom 0.305: U1.37 JP1.18
SD1
  Bottom 0.305: U1.36 JP1.17
SD2
  Bottom 0.305: JP2.4 U1.16
SD3
  Bottom 0.305: JP2.3 U1.17
TX
  Bottom 0.305: U1.23 JP1.4

### Text on the board
tPlace: LM2576 | - | GND | Parallel Mode | Normal Mode | IN1=IN2 = 25 | IN1 = 32 | 12V | 1N5419 | IN3=IN4 = 26 | IN2 = 33 | J1 = SHORT | IN3 = 25 | J2 = SHORT | IN4 = 26 | + | Society of Robotics and Automation | Parallel Mode | Normal Mode | IN5=IN7 = 12 | IN5 = 27 | IN6=IN8 = 13 | IN6 = 14 | J3 = SHORT | IN7 = 12 | IN8 = 13 | J4 = SHORT | Mcu SW | MOTOR / FUSE | MCU / FUSE | Parallel / Mode | IN5=IN7=12, | IN6=IN8=13, | WALLE v2.2 2021 | J3 = SHORT | J4 = SHORT | C:/Users/User/Desktop/WhatsApp Image 2019-09-02 at 12.38.29 AM.bmp | Parallel / Mode | IN6=IN8=13, | IN5=IN7=12, | USE ME | J3 = SHORT | J4 = SHORT
bPlace: M1A | M3A | J1 | M2A | M4A | J2 | M1B | M3B | J3 | M2B | M4B | J4
tNames: 1N5822 | FD | D3 | MPU | 21 | 22(SDA) | GND | NC | 35 | 34 | 39 | 36 | LSA | GND | 23(SCL) | 3.3V | NC | NC | NC | GND | 3.3V | 5V | 3.3V | D2 | 1N5399 | GND | D4 | 5V | 3.3V | GND | 32 | 33 | 25 | 26 | 27 | 14 | 12 | 13 | 5V | 3.3V | IN1 | IN2 | IN3 | IN4 | IN5 | IN6 | IN7 | IN8 | SERVO | PORT | 1N5822 | 5 | 18 | D1 | TB_A | SW1 | SW4 | 4 | 16 | 19 | PWM | VCC / (5V) | GND | (5v) | TB_B | SW2 | SW3 | 2 | 17 | Motor SW | On = Parallel Mode / Off = Normal Mode | 3.3V | GND | (12v) | TB_A | EN | 23 | VM | PWM1 | M1A | VP | IN2 | 22 | 3.3V | VN | TX | GND | IN1 | M1B | 34 | STBY | RX | M1A | 15 | 35 | 21 | M1B | IN3 | M2A | 32 | GND | M2B | IN4 | 33 | 19 | M2A | PWM2 | M2B | 25 | 18 | GND | GND | 5 | TB_B | 26 | M3A | 27 | 17 | VM | PWM3 | 14 | 16 | 3.3V | IN6 | M3B | 12 | 4 | GND | IN5 | M3A | STBY | 0 | 0 | GND | M4A | 13 | 2 | M3B | IN7 | M4B | IN8 | 15 | D2 | M4B | D3 | D1 | M4A | PWM4 | GND | GND | CMD | D0 | 5V | CLK | (J1, J2 , J3 and J4 are on the / back of PCB)